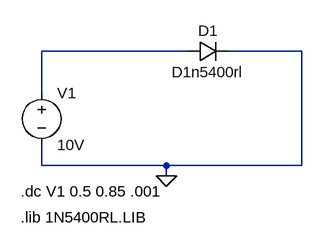
[diagram p0: schematic Diode_1N5400.asc]
Diode_1N5400.asc, the LTspice schematic file:
Version 4
SHEET 1 956 680
WIRE 256 112 32 112
WIRE 432 112 320 112
WIRE 32 176 32 112
WIRE 32 288 32 256
WIRE 224 288 32 288
WIRE 432 288 432 112
WIRE 432 288 224 288
WIRE 224 304 224 288
FLAG 224 304 0
SYMBOL diode 256 128 R270
WINDOW 0 32 32 VTop 2
WINDOW 3 0 32 VBottom 2
SYMATTR InstName D1
SYMATTR Value D1n5400rl
SYMBOL voltage 32 160 R0
SYMATTR InstName V1
SYMATTR Value 10V
TEXT 0 328 Left 2 !.dc V1 0.5 0.85 .001
TEXT 0 368 Left 2 !.lib 1N5400RL.LIB

The netlist it stands for:
* Diode_1N5400.asc
D1 N001 0 D1n5400rl
V1 N001 0 10V
.model D D
.lib standard.dio
.dc V1 0.5 0.85 .001
.lib 1N5400RL.LIB
.backanno
.end